# EAGLE design 17_SPRINKL (EAGLE 9.6.2)

## Sheet 1 of 4
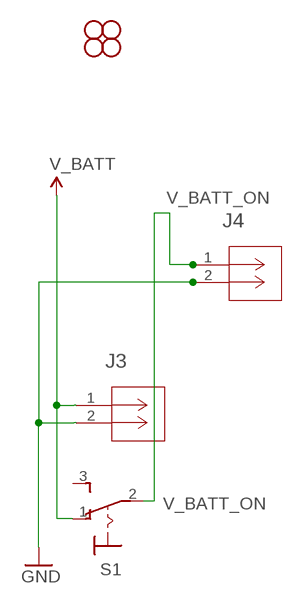
[diagram p0: schematic, sheet 1]

### Parts
J3  1729128  [CONN_1729128_PXC]
J4  1729128  [CONN_1729128_PXC]
S1  M9040P  [M9040P]
STANDOFF1  STAND-OFF  [STAND-OFF]
STANDOFF2  STAND-OFF  [STAND-OFF]
STANDOFF3  STAND-OFF  [STAND-OFF]
STANDOFF4  STAND-OFF  [STAND-OFF]

### Nets
GND: J3.2 J4.2 ; also sheet 2
V_BATT: J3.1 S1.1(O)
V_BATT_ON: J4.1 S1.2(P) ; also sheet 2
Unconnected: S1.3(S)

## Sheet 2 of 4
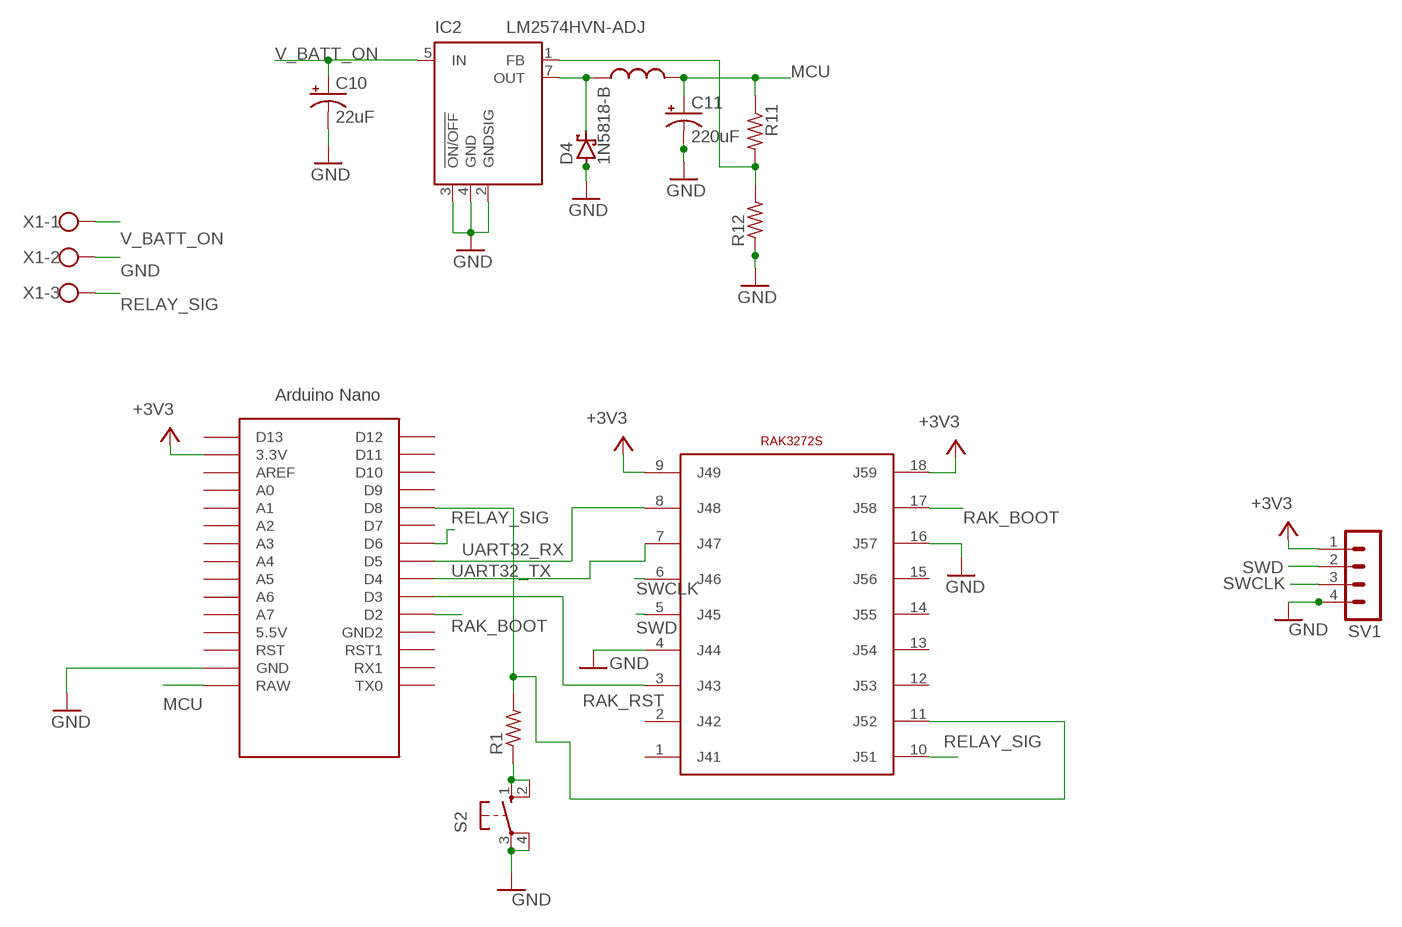
[diagram p1: schematic, sheet 2]

### Parts
C10  22uF  CPOL-USE5-6  [E5-6]
C11  220uF  CPOL-USE5-6  [E5-6]
D4  1N5818-B  [DO41-7.6]
IC2  LM2574HVN-ADJ  [DIL08]
R1  R-US_0204/7  [0204/7]
R11  R-US_0204/7  [0204/7]
R12  R-US_0204/7  [0204/7]
S2  10-XX  [B3F-10XX]
SV1  MA04-1  [MA04-1]
U$1  330UH_INDUCTOR  [330UH_INDUCTOR]
U$3  NANO  [NANO]
U$4  RAK3272S  [RAK3272SFOOTPRINT]
X1  W237-103  [W237-103]

### Nets
+3V3: SV1.1 U$3.3.3V U$4.9(J49) U$4.18(J59)
GND: C10.- C11.- D4.A IC2.2(GNDSIG) IC2.3(!ON/OFF) IC2.4(GND) R12.1 S2.3(P) S2.4(P1) SV1.4 U$3.GND U$4.4(J44) U$4.16(J57) X1.2 ; also sheet 1
MCU: C11.+ R11.1 U$1.P$2 U$3.RAW
N$3: D4.C IC2.7(OUT) U$1.P$1
N$4: R1.1 S2.1(S) S2.2(S1)
N$5: IC2.1(FB) R11.2 R12.2
N$8: R1.2 U$3.D8 U$4.11(J52)
RAK_BOOT: U$3.D2 U$4.17(J58)
RAK_RST: U$3.D3 U$4.3(J43)
RELAY_SIG: U$3.D6 U$4.10(J51) X1.3
SWCLK: SV1.3 U$4.6(J46)
SWD: SV1.2 U$4.5(J45)
UART32_RX: U$3.D4 U$4.7(J47)
UART32_TX: U$3.D5 U$4.8(J48)
V_BATT_ON: C10.+ IC2.5(IN) X1.1 ; also sheet 1
Unconnected: U$3.5V(5.5V) U$3.A0 U$3.A1 U$3.A2 U$3.A3 U$3.A4 U$3.A5 U$3.A6 U$3.A7 U$3.AREF U$3.D7 U$3.D9 U$3.D10 U$3.D11 U$3.D12 U$3.D13 U$3.GND1(GND2) U$3.ICSP1 U$3.ICSP2 U$3.ICSP3 U$3.ICSP4 U$3.ICSP5 U$3.ICSP6 U$3.RST U$3.RST1 U$3.RX1 U$3.TX0 U$4.1(J41) U$4.2(J42) U$4.12(J53) U$4.13(J54) U$4.14(J55) U$4.15(J56)

## Sheet 3 of 4

## Sheet 4 of 4

## Library data of the parts
C10 C11 = rcl:CPOL-US: POLARIZED CAPACITOR, American symbol; SPICEPREFIX: C
D4 = diode:1N581*: 1.0A SCHOTTKY BARRIER RECTIFIER Source: http://www.diodes.com/datasheets/ds23001.pdf
IC2 = linear:LM2574?-*: SIMPLE SWITCHER 0.5A Step-Down Voltage Regulator Source: http://cache.national.com/ds/LM/LM2574.pdf
J3 J4 = ece490capestone:1729128; COPYRIGHT: Copyright (C) 2023 Ultra Librarian. All rights reserved.; DIGI-KEY_PART_NUMBER_1: 277-1247-ND; MANUFACTURER_PART_NUMBER: 1729128; MFR_NAME: Phoenix Contact
R1 R11 R12 = rcl:R-US_: RESISTOR, American symbol; SPICEPREFIX: R
S1 = switch:M9040P: TOGGLE SWITCH Marquardt
S2 = switch-omron:10-XX: OMRON SWITCH; MPN: B3F-1000; OC_FARNELL: 176432; OC_NEWARK: 36M3542
STANDOFF1-STANDOFF4 = SparkFun-Electromechanical:STAND-OFF: #4 Stand Off This is the mechanical footprint for a #4 phillips button head screw. Use the keepout ring to avoid running the screw head into surrounding components. SKU : PRT-00447
SV1 = con-lstb:MA04-1: PIN HEADER; OC_FARNELL: unknown; OC_NEWARK: unknown
U$1 = ece490capestone:330UH_INDUCTOR
U$3 = Arduino-clone:NANO: Arduino Nano
U$4 = ece490capestone:RAK3272S
X1 = con-wago-500:W237-103: WAGO SCREW CLAMP; MPN: 237-103; OC_FARNELL: unknown; OC_NEWARK: 18M7116

## Board
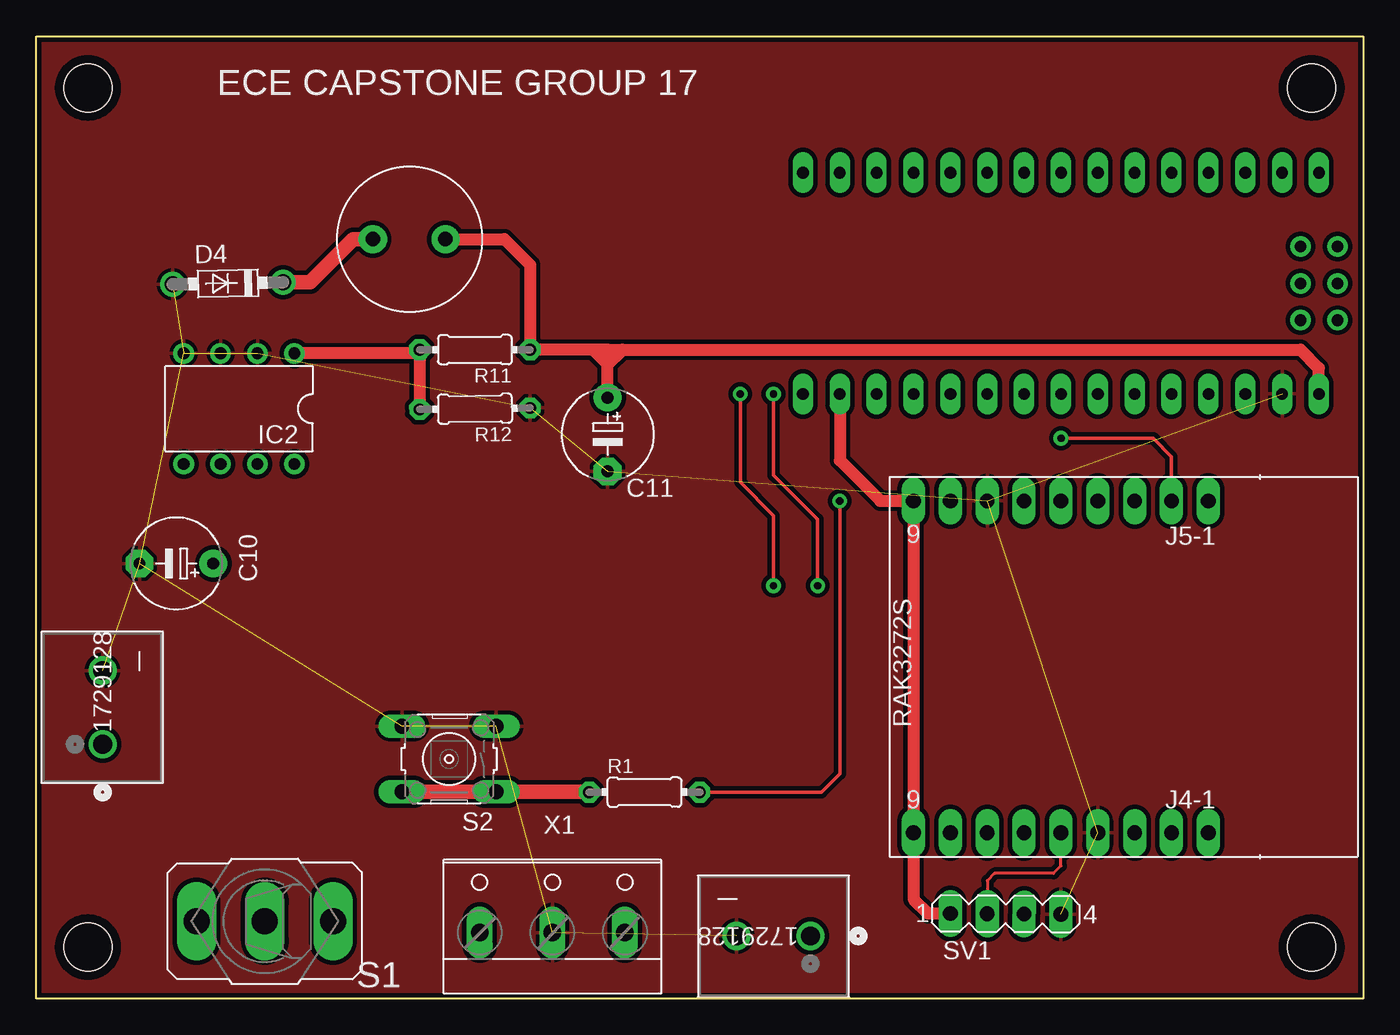
[diagram p2: board, top side]
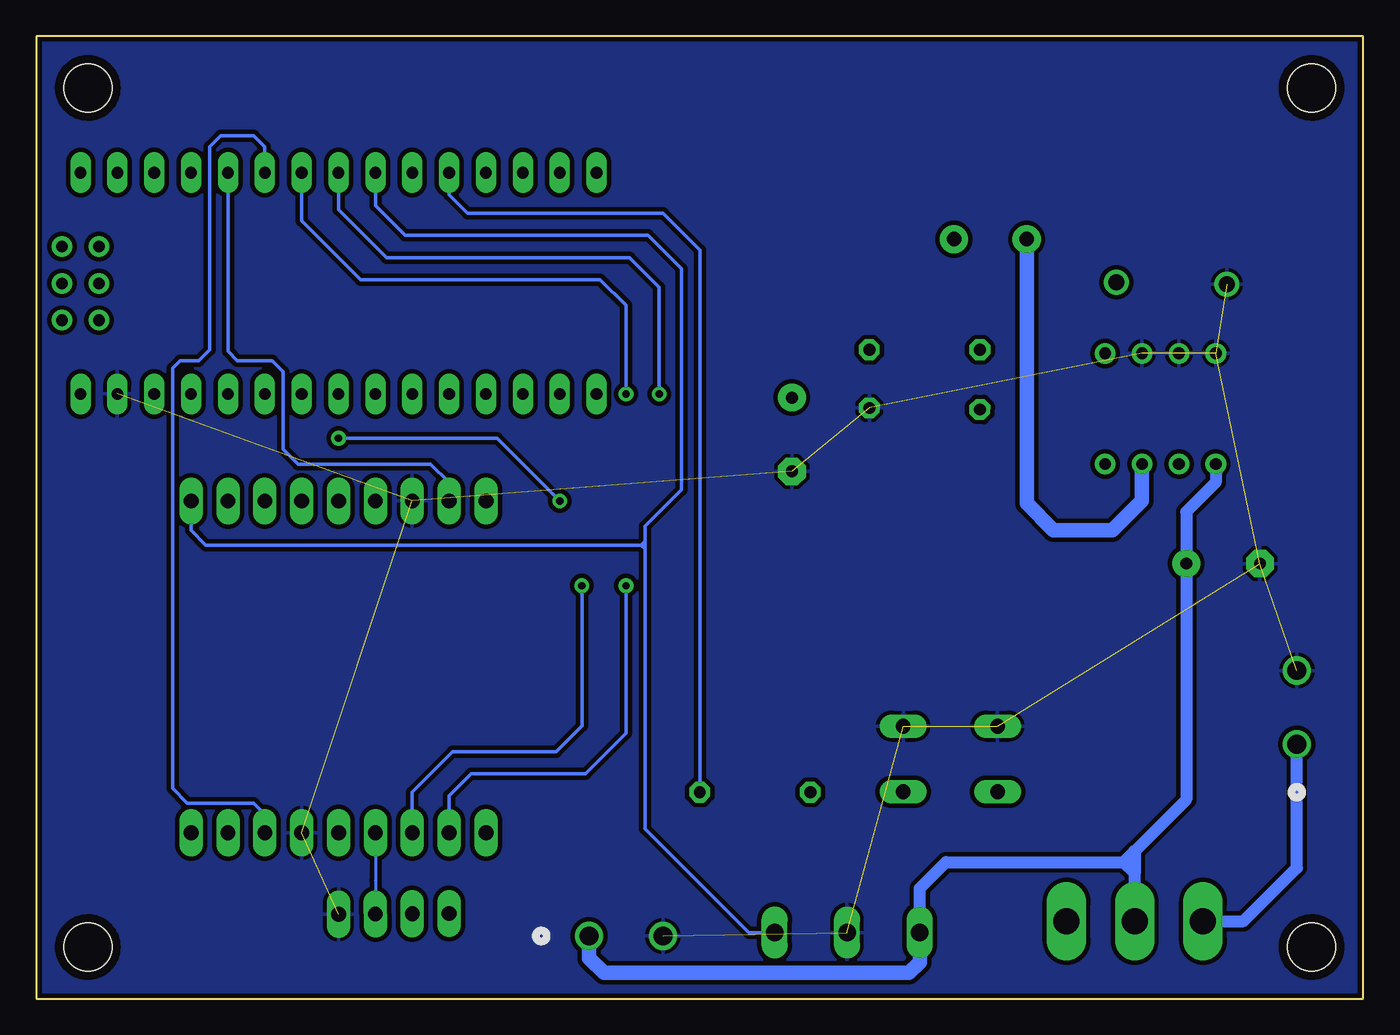
[diagram p3: board, bottom side, seen from below]

Size 91.44 x 66.29 mm. Coordinates in mm from the lower left corner, seen from the top.
Outline: 0,66.29 91.44,66.29 91.44,0 0,0 0,66.29
Copper layers (1*16): Top 0.035mm / dielectric 1.5mm / Bottom 0.035mm
Design rules "Sparkfun": minimum track width 8mil, minimum drill 20mil, track to track 8mil, track to pad 8mil, pad to pad 8mil, via to via 8mil, smd to smd 8mil, copper to edge 8mil, drill to drill 8mil, minimum pad ring 12mil, minimum via ring 10mil, stop-mask expansion 4mil, vias tented up to drill 20mil, thermal gap 10mil

### Footprints (pad centres in the part's own frame; a part is rotated, then mirrored left to right if it is on the bottom)
E5-6 = drill 0.813 pad 1.905: + -2.54,0 | drill 0.813 pad 1.905 octagon: - 2.54,0
DO41-7.6 = drill 1.1 pad 1.7: A 3.81,0; C -3.81,0
DIL08 = drill 0.813 pad 1.27: 1 -3.81,-3.81; 2 -1.27,-3.81; 3 1.27,-3.81; 4 3.81,-3.81; 5 3.81,3.81; 6 1.27,3.81; 7 -1.27,3.81; 8 -3.81,3.81
CONN_1729128_PXC = drill 1.295 pad 1.803: 1 0,0; 2 5.08,0
0204/7 = drill 0.813 octagon: 1 -3.81,0; 2 3.81,0
M9040P = drill 1.803 long: 1 0,4.699; 2 0,0; 3 0,-4.699
B3F-10XX = drill 1.016 long: 1 -3.251,2.261; 2 3.251,2.261; 3 -3.251,-2.261; 4 3.251,-2.261
STAND-OFF = hole 3.302: 0,0
MA04-1 = drill 1.016 long: 1 -3.81,0; 2 -1.27,0; 3 1.27,0; 4 3.81,0
330UH_INDUCTOR = drill 1.016 pad 1.93: P$1 -5,0; P$2 0,0
NANO = drill 0.8 long: 3.3V -10.16,24.13; 5V -10.16,-1.27; A0 -10.16,19.05; A1 -10.16,16.51; A2 -10.16,13.97; A3 -10.16,11.43; A4 -10.16,8.89; A5 -10.16,6.35; A6 -10.16,3.81; A7 -10.16,1.27; AREF -10.16,21.59; D2 5.08,1.27; D3 5.08,3.81; D4 5.08,6.35; D5 5.08,8.89; D6 5.08,11.43; D7 5.08,13.97; D8 5.08,16.51; D9 5.08,19.05; D10 5.08,21.59; D11 5.08,24.13; D12 5.08,26.67; D13 -10.16,26.67; GND -10.16,-6.35; GND1 5.08,-1.27; RAW -10.16,-8.89; RST -10.16,-3.81; RST1 5.08,-3.81; RX1 5.08,-6.35; TX0 5.08,-8.89 | drill 0.8: ICSP1 -5.08,-10.16; ICSP2 -5.08,-7.62; ICSP3 -2.54,-10.16; ICSP4 -2.54,-7.62; ICSP5 0,-10.16; ICSP6 0,-7.62
RAK3272SFOOTPRINT = drill 1.016 long: 1 11.43,10.16; 2 11.43,7.62; 3 11.43,5.08; 4 11.43,2.54; 5 11.43,0; 6 11.43,-2.54; 7 11.43,-5.08; 8 11.43,-7.62; 9 11.43,-10.16; 10 -11.43,10.16; 11 -11.43,7.62; 12 -11.43,5.08; 13 -11.43,2.54; 14 -11.43,0; 15 -11.43,-2.54; 16 -11.43,-5.08; 17 -11.43,-7.62; 18 -11.43,-10.16
W237-103 = drill 1.194 long: 1 -5,-1.29; 2 0,-1.29; 3 5,-1.29

### Placement (x,y rotation side)
C10  9.65,29.97 180 top
C11  39.37,38.86 270 top
D4  13.21,49.28 181.1 top
IC2  13.97,40.64 180 top
J3  4.57,17.53 90 top
J4  53.34,4.32 180 top
R1  41.91,14.22 0 top
R11  30.23,44.7 180 top
R12  30.23,40.64 180.8 top
S1  15.75,5.33 90 top
S2  28.45,16.51 180 top
STANDOFF1  3.56,3.56 0 top
STANDOFF2  3.56,62.74 0 top
STANDOFF3  87.88,62.74 0 top
STANDOFF4  87.88,3.56 0 top
SV1  66.8,5.84 359.6 top
U$1  28.19,52.32 0 top
U$3  79.5,51.82 90 top
U$4  70.61,22.86 270 top
X1  35.56,5.84 0 top

### Tracks (layer width: path | path; a pad name or v marks a point on that pad's centre or on a via)
+3V3
  Top 0.813: U$3.3.3V 55.37,37.08 58.17,34.29 U$4.18 U$4.9 60.45,6.86 61.44,5.87 SV1.1
GND  (15 unrouted)
  pour Bottom (isolate 0.305): 0,66.29 0,0 91.44,0 91.44,66.29
  pour Top (isolate 0.305): 0,66.29 0,0 91.44,0 91.44,66.29
MCU
  Top 0.813: U$1.P$2 32.26,52.32 34.04,50.55 R11.1 38.35,44.7 | U$3.RAW 88.39,43.43 87.12,44.7 40.39,44.7 | 39.37,44.7 40.39,44.7 | C11.+ 39.37,43.69 | 39.37,44.7 39.37,43.69 | 39.37,44.7 38.35,44.7 | 39.37,43.69 38.35,44.7 | 39.37,43.69 40.39,44.7
N$3
  Top 1.016: D4.C 18.87,49.35 21.84,52.32 U$1.P$1
  Bottom 1.016: U$1.P$1 23.19,34.12 21.34,32.26 17.27,32.26 15.24,34.29 IC2.7
N$4
  Top 1.016: R1.1 38.08,14.25 S2.1 S2.2
N$5
  Top 0.813: IC2.1 26.16,44.45 R11.2 R12.2 | R12.2
N$8  (via drill 0.51)
  Top 0.254: R1.2 54.1,14.22 55.37,15.49 v55.37,34.29 | v70.61,38.61 76.96,38.61 78.23,37.34 U$4.11
  Bottom 0.254: U$3.D8 62.99,55.37 61.72,54.1 48.26,54.1 45.72,51.56 R1.2 | v55.37,34.29 59.69,38.61 v70.61,38.61
RAK_BOOT
  Bottom 0.254: U$3.D2 78.23,44.59 77.59,43.94 75.18,43.94 74.42,43.18 74.42,37.85 73.41,36.83 64.26,36.83 62.99,35.56 U$4.17
RAK_RST
  Bottom 0.254: U$4.3 75.69,12.7 76.45,13.46 81.03,13.46 82.04,14.48 82.04,43.43 81.53,43.94 80.26,43.94 79.5,44.7 79.5,58.67 78.74,59.44 76.45,59.44 75.69,58.67 U$3.D3
RELAY_SIG
  Bottom 0.254: 49.51,30.99 49.51,11.72 42.34,4.55 X1.3 | 49.51,30.99 49.51,31.5 | 49.51,31.5 49.51,32.54 46.99,35.05 46.99,50.29 49.28,52.58 66.04,52.58 68.07,54.61 U$3.D6 | U$4.10 80.77,32.26 79.76,31.24 49.76,31.24 | 49.76,31.24 49.51,31.5 | 49.76,31.24 49.51,30.99
SWCLK
  Bottom 0.203: U$4.6 68.07,8.13 | 68.07,8.13 SV1.3 | 68.07,8.13
SWD
  Top 0.203: U$4.5 70.61,9.14 70.1,8.64 66.04,8.64 65.53,8.13 SV1.2 | SV1.2
UART32_RX  (via drill 0.51)
  Top 0.254: v53.85,28.45 53.85,33.02 50.8,36.07 v50.8,41.66
  Bottom 0.254: U$4.7 65.53,14.22 62.74,17.02 55.63,17.02 53.85,18.8 v53.85,28.45 | v50.8,41.66 50.8,47.75 52.58,49.53 69.09,49.53 73.15,53.59 U$3.D4
UART32_TX  (via drill 0.51)
  Top 0.254: v50.8,28.45 50.8,33.27 48.51,35.56 v48.51,41.66
  Bottom 0.254: U$4.8 62.99,13.97 61.47,15.49 53.59,15.49 50.8,18.29 v50.8,28.45 | v48.51,41.66 48.51,49.02 50.55,51.05 67.31,51.05 70.61,54.36 U$3.D5
V_BATT
  Bottom 0.813: S1.1 8.26,5.33 4.57,9.02 J3.1
V_BATT_ON
  Bottom 0.254: 16.51,9.4 16.52,9.41
  Bottom 0.813: IC2.5 10.16,35.56 12.19,33.53 C10.+ 12.19,13.72 15.75,10.16 | 16.52,9.41 28.75,9.41 30.56,7.6 X1.1 30.54,4.57 | 16.24,9.41 16.52,9.41 | 15.75,8.64 16.52,9.41 | S1.2 15.75,8.64 | 16.52,9.41 15.77,10.16 15.75,10.16 | 15.75,10.16 15.75,8.64
  Bottom 1.016: X1.1 30.56,2.52 31.3,1.78 52.32,1.78 53.34,2.79 J4.1

### Text on the board
tNames: ECE CAPSTONE GROUP 17